# EAGLE board SWD (EAGLE 7.4.0), part 1 of 2
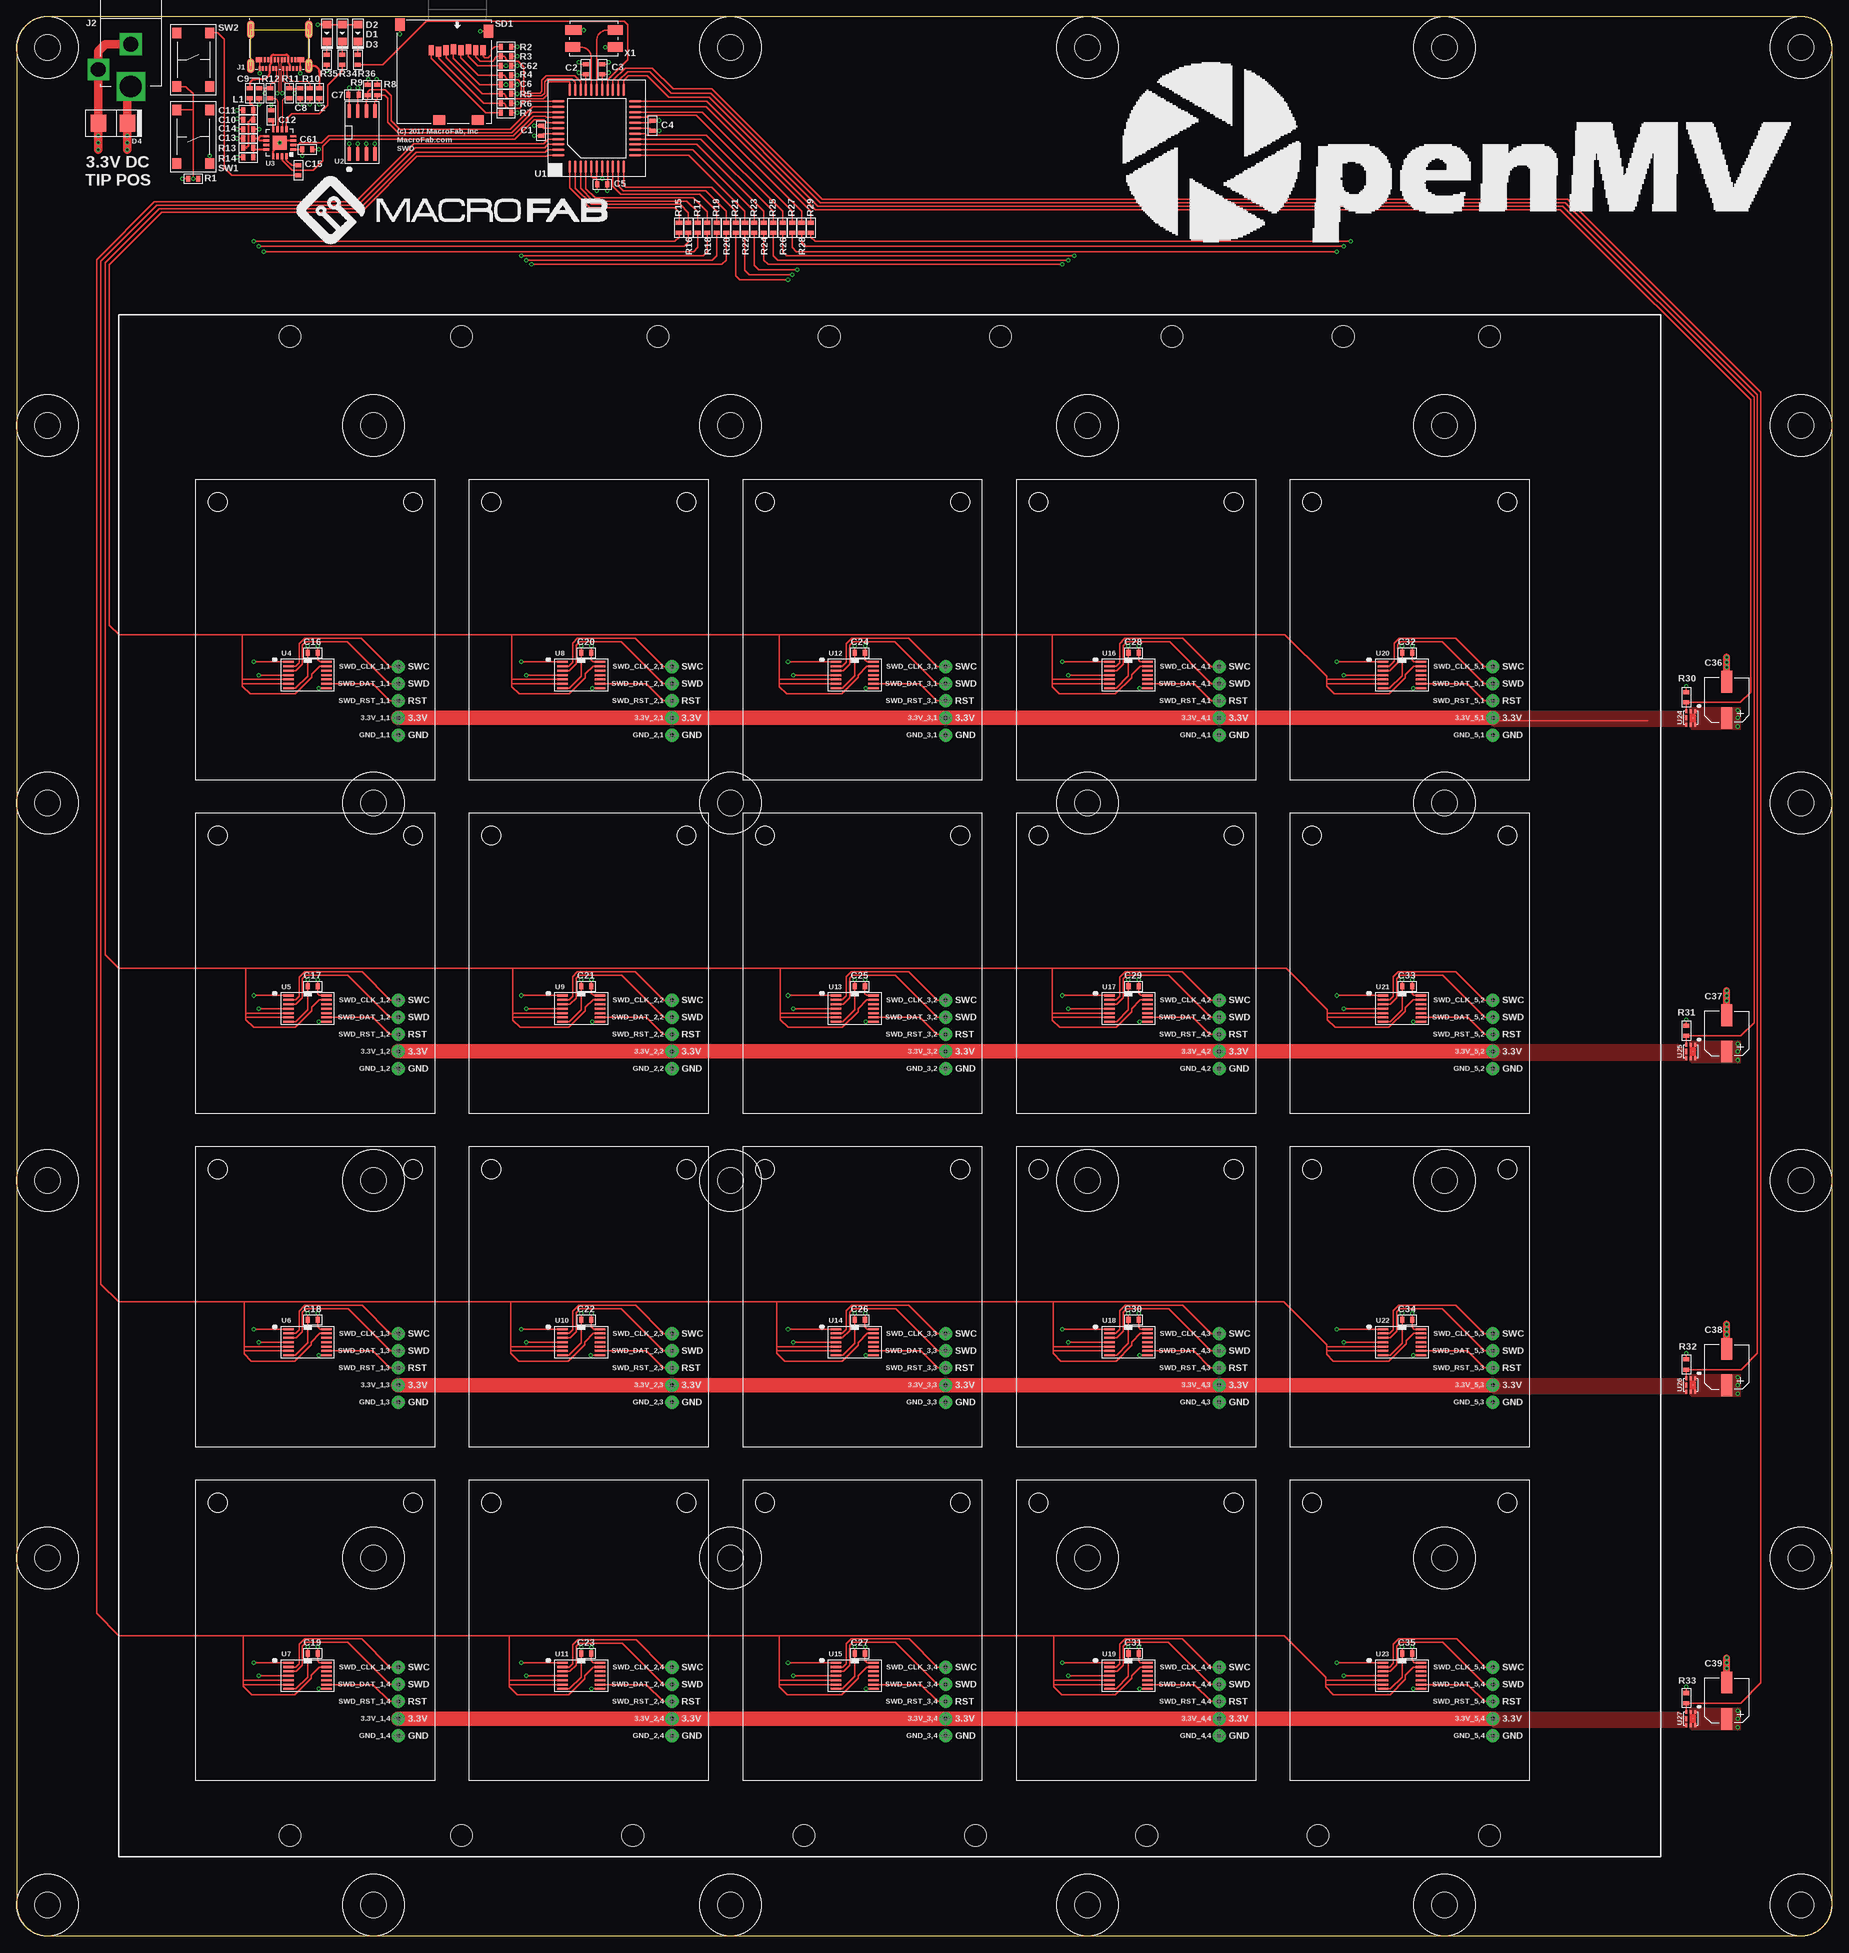
[diagram p9: board, top side]
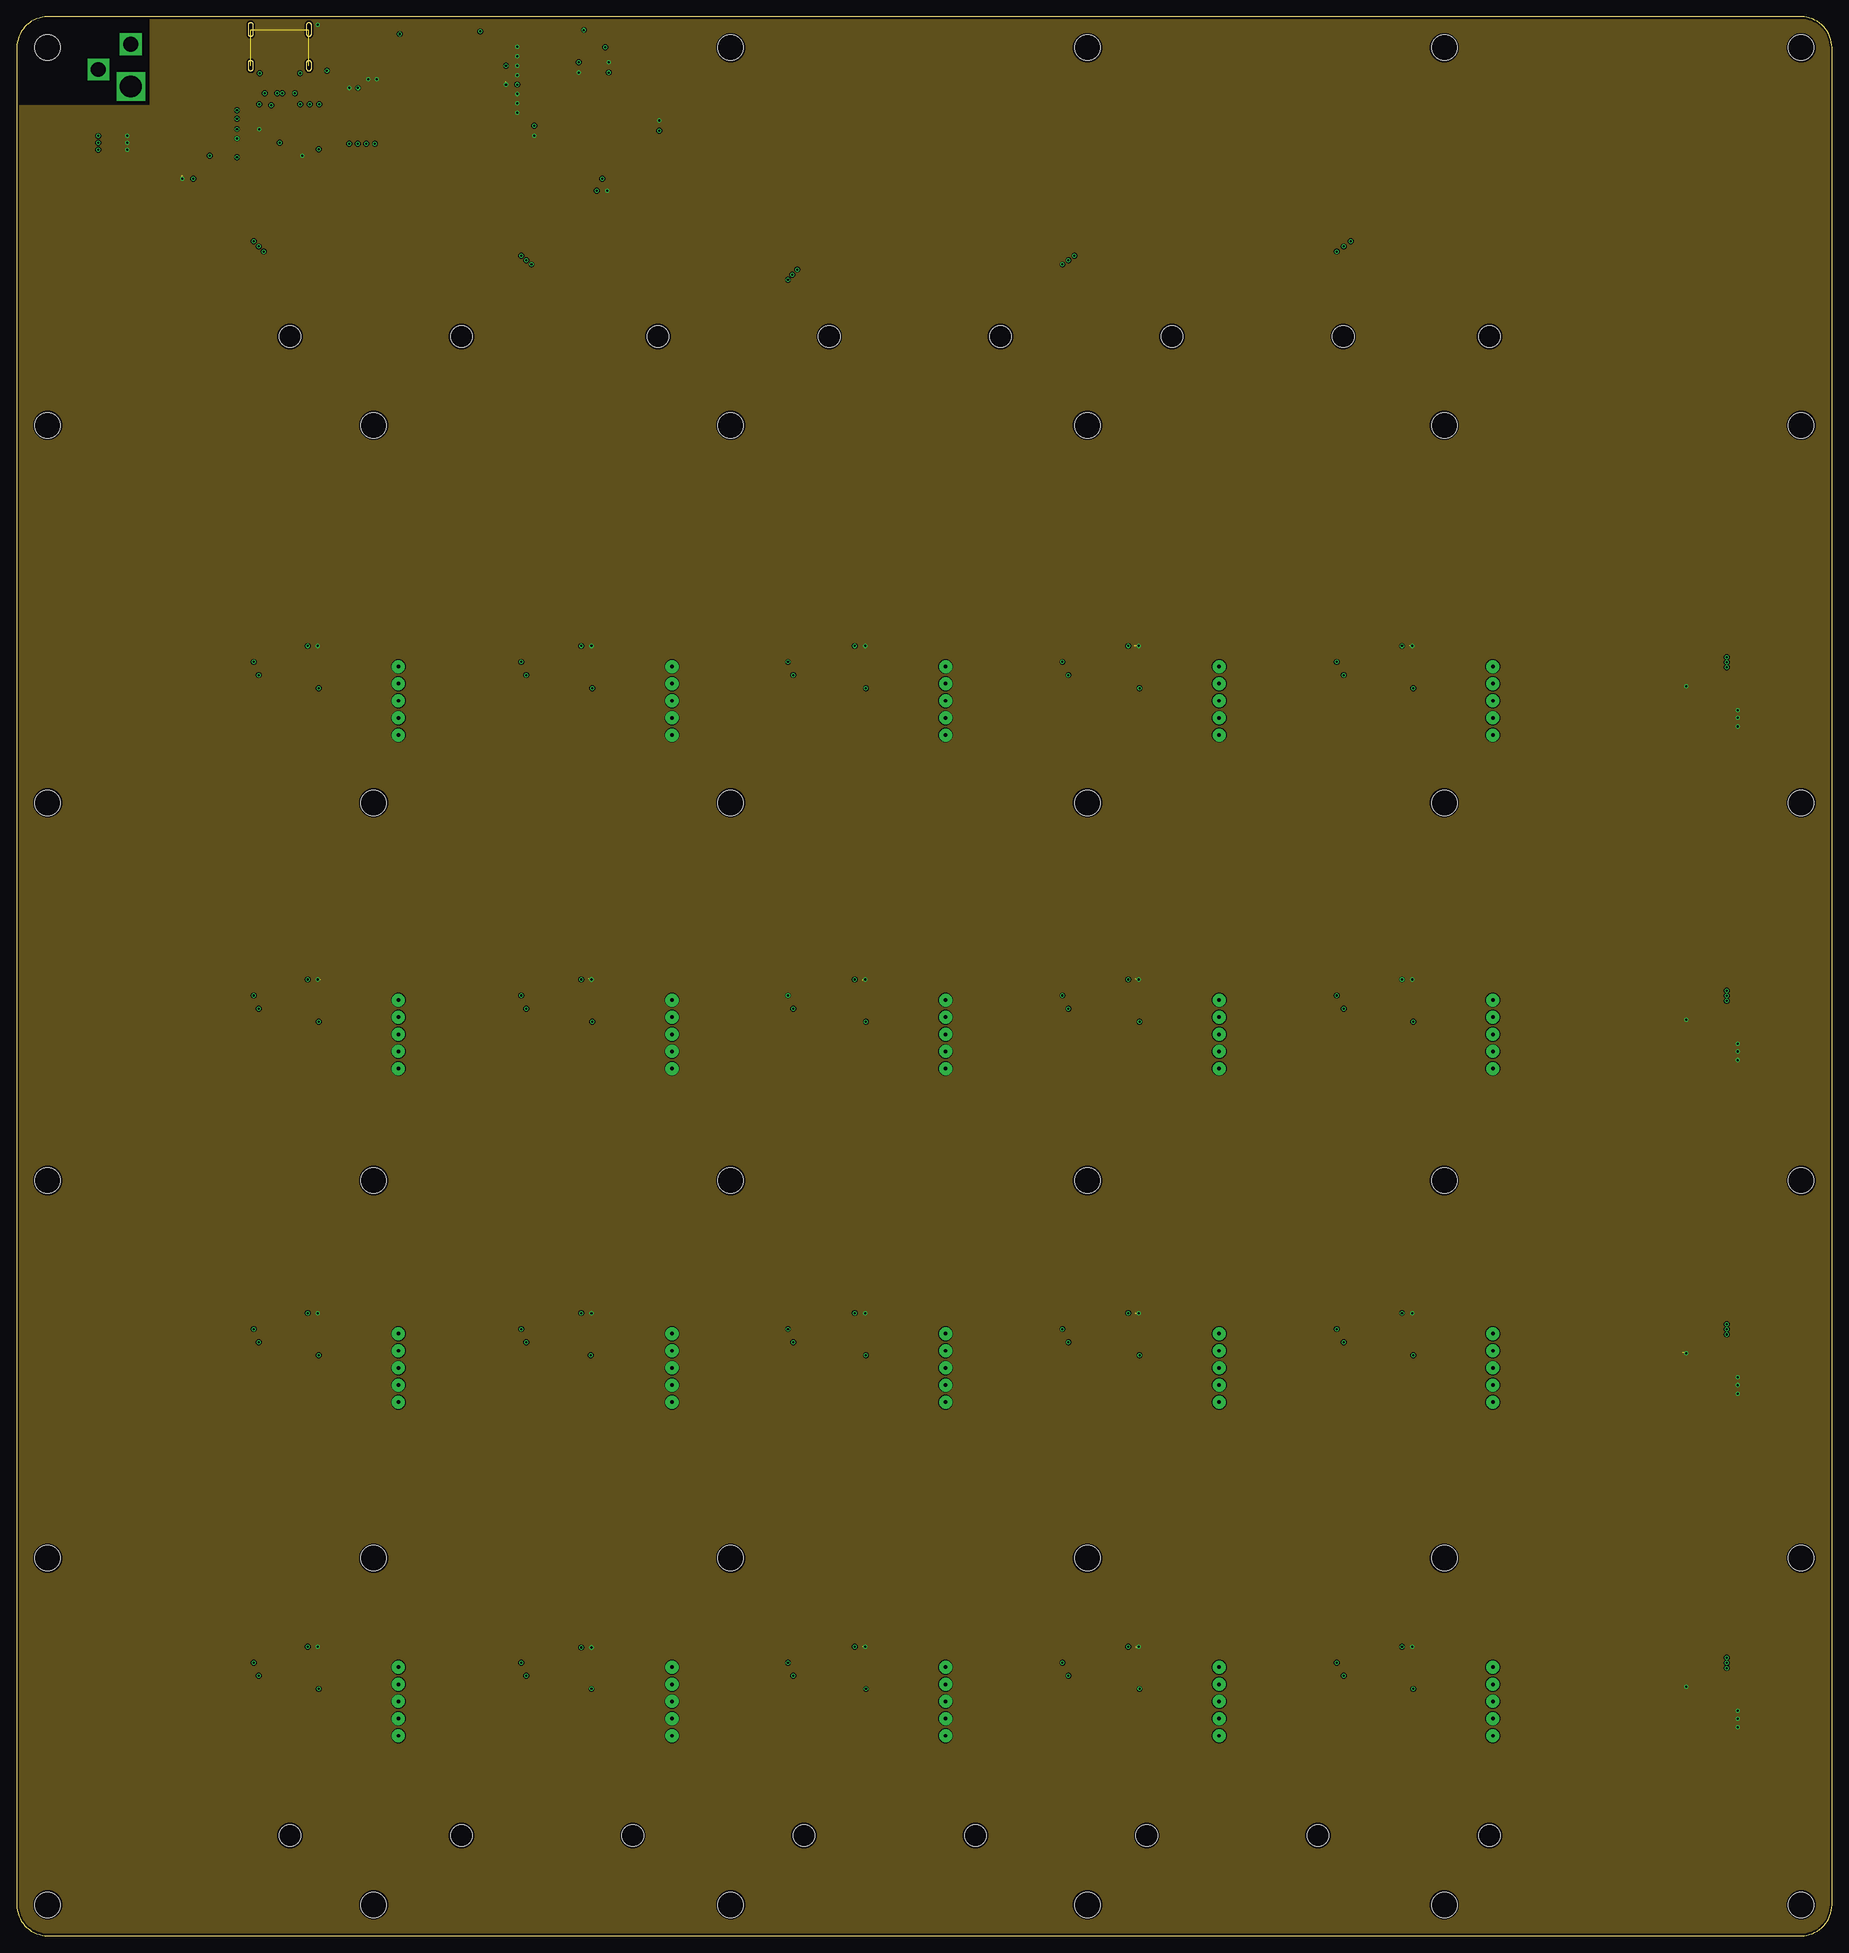
[diagram p10: board, inner layer 3.3V]
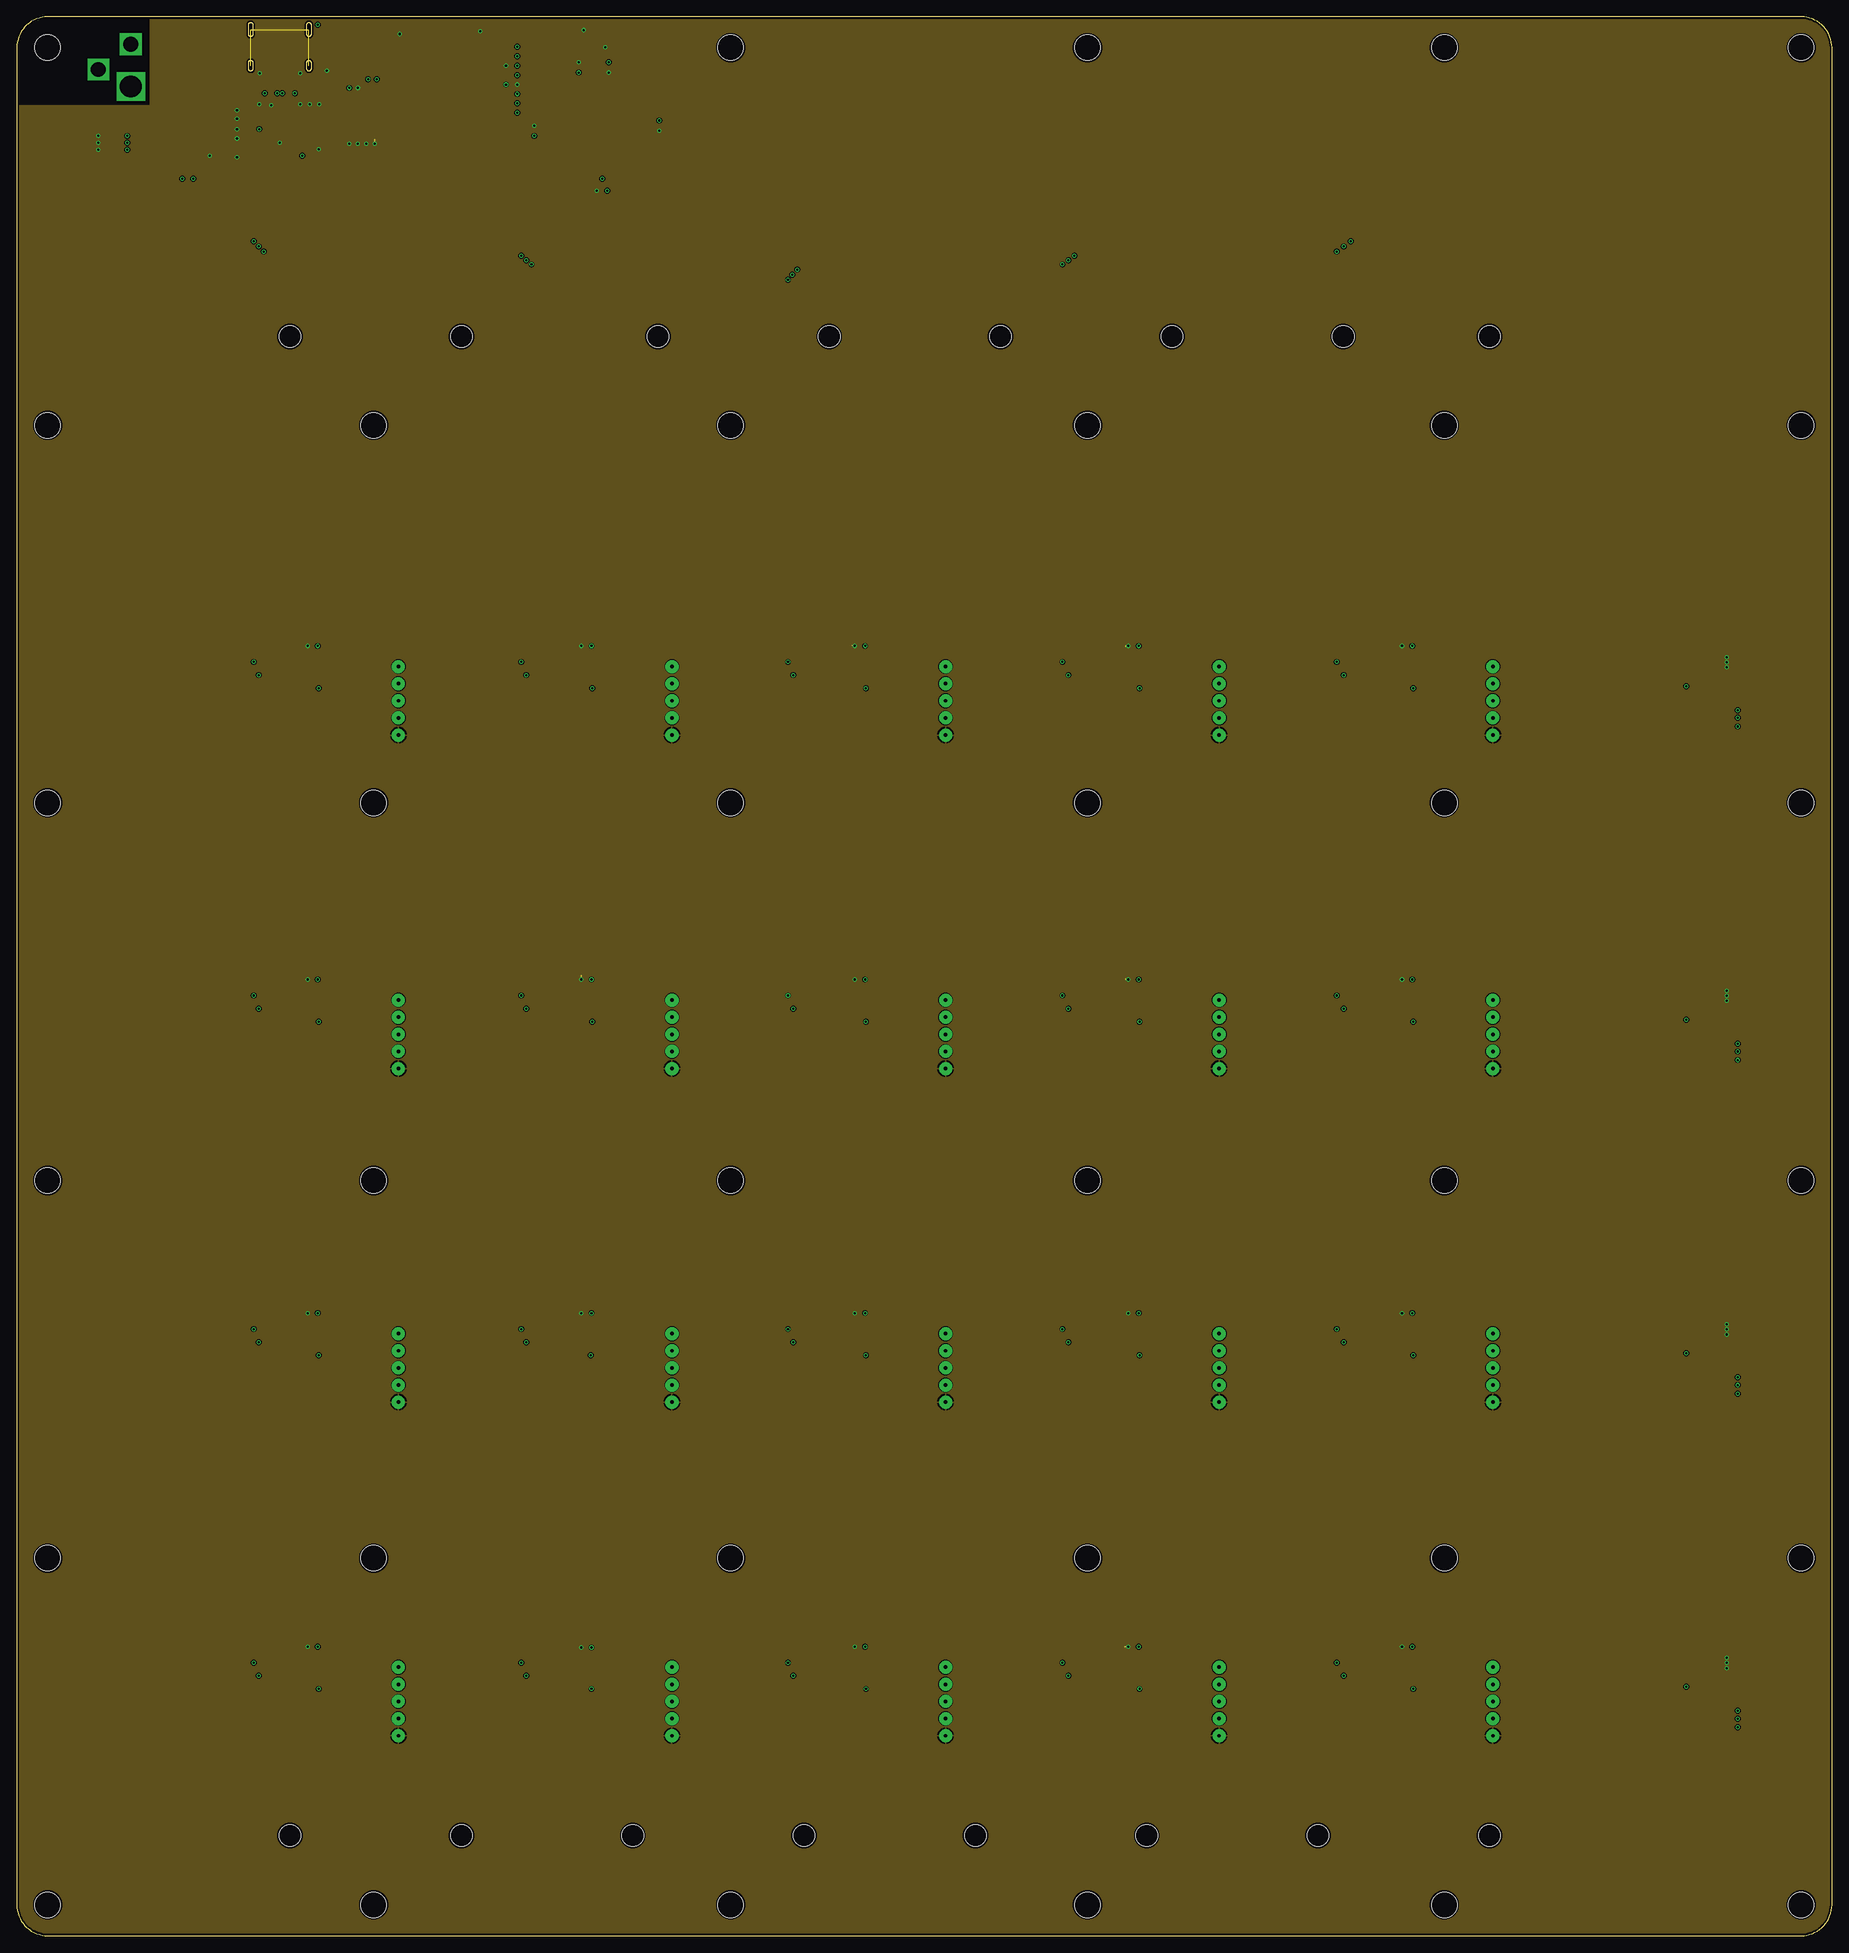
[diagram p11: board, inner layer GND]
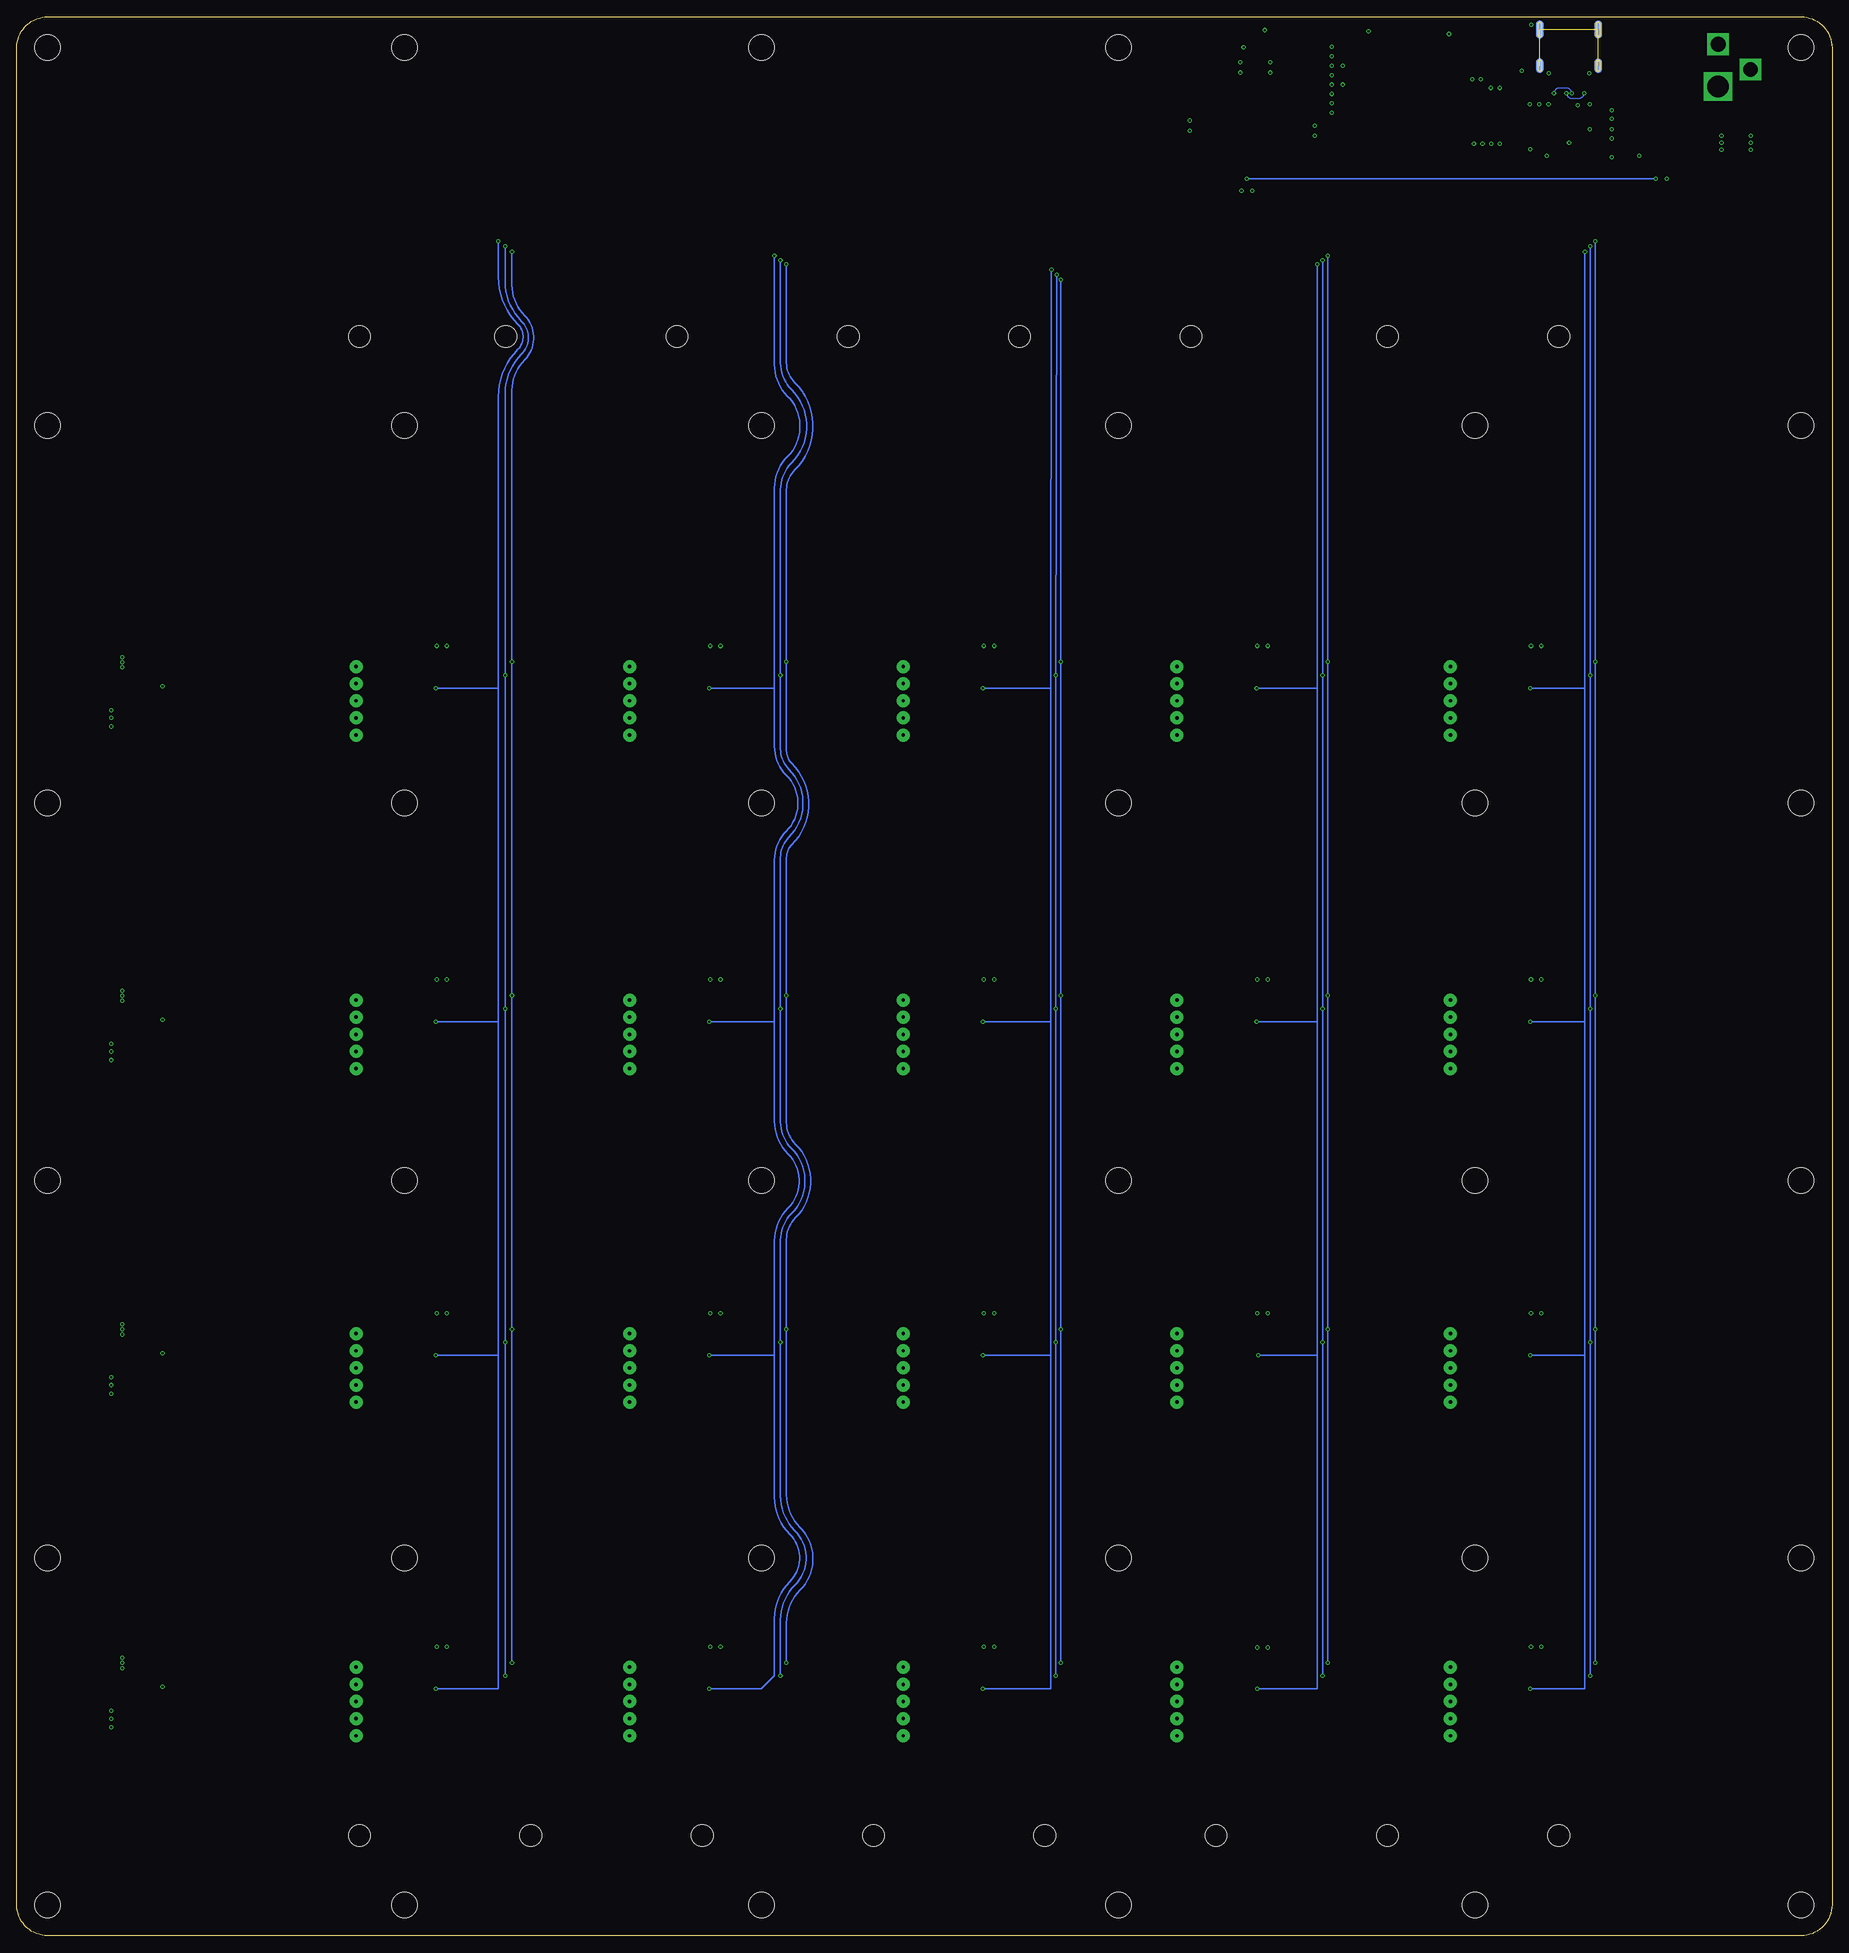
[diagram p12: board, bottom side, seen from below]

Size 269.11 x 284.48 mm. Coordinates in mm from the lower left corner, seen from the top.
Outline: 0,279.91 0,4.57 arc90 4.57,0 264.54,0 arc90 269.11,4.57 269.11,279.91 arc90 264.54,284.48 4.57,284.48 arc90 0,279.91
Copper layers (1*2*15*16): Top 0.035mm / dielectric 0.23mm / 3.3V 0.035mm / dielectric 0.93mm / GND 0.035mm / dielectric 0.23mm / Bottom 0.035mm
Design rules "MF_Standard_4_Layer": minimum track width 5mil, minimum drill 12mil, track to track 5mil, track to pad 5mil, pad to pad 5mil, via to via 5mil, smd to smd 0mil, copper to edge 10mil, drill to drill 10mil, minimum pad ring 6mil, minimum via ring 6mil, stop-mask expansion 2mil, vias tented up to drill 25mil, thermal gap 10mil
Holes 3.25 mm at 40.51,14.86 65.91,14.86 91.31,14.86 116.71,14.86 142.11,14.86 167.51,14.86 192.91,14.86 218.31,14.86 218.31,237.11 196.65,237.11 171.25,237.11 145.85,237.11 120.45,237.11 95.05,237.11 65.91,237.11 40.51,237.11

## Footprints (pad centres in the part's own frame; a part is rotated, then mirrored left to right if it is on the bottom)
0908-4-15-20-75-14-11-0 = drill 0.508 pad 1.93: P$1 0,0
C0603 = smd 0.6 x 0.9: P$1 -0.75,0; P$2 0.75,0
CP6.3MM = smd 1.6 x 3.2: P$1 0,-2.7; P$2 0,2.7
LED0805 = smd 1.1 x 1.25: ANODE 1.25,0; CATHODE -1.25,0
SMBJ = smd 2.3 x 2.5: ANODE 2.15,0; CATH -2.15,0
105450-0101 = smd 0.3 x 0.7: A1 -3,0.41; A2 -2.5,0.41; A3 -2,0.41; A4 -1.5,0.41; A5 -1,0.41; A6 -0.5,0.41; A7 0.5,0.41; A8 1,0.41; A9 1.5,0.41; A10 2,0.41; A11 2.5,0.41; A12 3,0.41; B2 2.25,-0.89; B3 1.75,-0.89; B4 1.25,-0.89; B5 0.75,-0.89; B6 0.25,-0.89; B7 -0.25,-0.89; B8 -0.75,-0.89; B9 -1.25,-0.89; B10 -1.75,-0.89; B11 -2.25,-0.89 | smd 1 x 0.7: B1 3.1,-0.89; B12 -3.1,-0.89 | smd 1.1 x 2.6 bottom: S_B1 -4.32,-5.36; S_B4 4.32,-5.36 | smd 1.1 x 2.1 bottom: S_B2 -4.32,0; S_B3 4.32,0 | smd 1.1 x 2.6: S_T1 -4.32,-5.36; S_T4 4.32,-5.36 | smd 1.1 x 2.1: S_T2 -4.32,0; S_T3 4.32,0
DC_PWR_JACK = drill 3.2 square: PIN 6.25,0 | drill 2.2 square: SLEEVE1 0,0; SLEEVE2 3.75,-4.8
L0603 = smd 0.6 x 0.9: P$1 -0.75,0; P$2 0.75,0
R0603 = smd 0.6 x 0.9: P$1 -0.75,0; P$2 0.75,0
MF-MICROSD = smd 1.4 x 1.9: G0 -6.589,7.001; G1 6.561,6.001 | smd 0.8 x 1.5: PIN1 -1.939,3.151; PIN2 -0.839,2.951; PIN3 0.261,3.151; PIN4 1.361,3.351; PIN5 2.461,3.151; PIN6 3.561,3.351; PIN7 4.661,3.151; PIN8 5.761,3.151 | smd 1.8 x 1.4: PIN9 4.961,-7.149; PIN10 -0.739,-7.149
TACT6MM = smd 1.55 x 1.3: P$1 -3.975,2.45; P$2 3.975,2.45; P$3 -3.975,-2.45; P$4 3.975,-2.45
LQFP44 = smd 1.9 x 0.4: 1 -5.7,4; 2 -5.7,3.2; 3 -5.7,2.4; 4 -5.7,1.6; 5 -5.7,0.8; 6 -5.7,0; 7 -5.7,-0.8; 8 -5.7,-1.6; 9 -5.7,-2.4; 10 -5.7,-3.2; 11 -5.7,-4; 23 5.7,-4; 24 5.7,-3.2; 25 5.7,-2.4; 26 5.7,-1.6; 27 5.7,-0.8; 28 5.7,0; 29 5.7,0.8; 30 5.7,1.6; 31 5.7,2.4; 32 5.7,3.2; 33 5.7,4 | smd 0.4 x 1.9: 12 -4,-5.7; 13 -3.2,-5.7; 14 -2.4,-5.7; 15 -1.6,-5.7; 16 -0.8,-5.7; 17 0,-5.7; 18 0.8,-5.7; 19 1.6,-5.7; 20 2.4,-5.7; 21 3.2,-5.7; 22 4,-5.7; 34 4,5.7; 35 3.2,5.7; 36 2.4,5.7; 37 1.6,5.7; 38 0.8,5.7; 39 0,5.7; 40 -0.8,5.7; 41 -1.6,5.7; 42 -2.4,5.7; 43 -3.2,5.7; 44 -4,5.7
SOIC-8_W = smd 2 x 0.5: 1 -3.185,1.905; 2 -3.185,0.635; 3 -3.185,-0.635; 4 -3.185,-1.905; 5 3.185,-1.905; 6 3.185,-0.635; 7 3.185,0.635; 8 3.185,1.905
FT230X_QFN-16 = smd 0.9 x 0.35: 1 -2,0.975; 2 -2,0.325; 3 -2,-0.325; 4 -2,-0.975; 9 2,-0.975; 10 2,-0.325; 11 2,0.325; 12 2,0.975 | smd 0.35 x 0.9: 5 -0.975,-2; 6 -0.325,-2; 7 0.325,-2; 8 0.975,-2; 13 0.975,2; 14 0.325,2; 15 -0.325,2; 16 -0.975,2 | smd 2.1 x 2.1: PAD 0,0
SN74LV4066A_TSSOP-14 = smd 1.55 x 0.3: P$1 -2.8,1.95; P$2 -2.8,1.3; P$3 -2.8,0.65; P$4 -2.8,0; P$5 -2.8,-0.65; P$6 -2.8,-1.3; P$7 -2.8,-1.95; P$8 2.8,-1.95; P$9 2.8,-1.3; P$10 2.8,-0.65; P$11 2.8,0; P$12 2.8,0.65; P$13 2.8,1.3; P$14 2.8,1.95
SSM6J507NU = smd 0.55 x 0.3: P$1 -1,0.65; P$2 -1,0; P$3 -1,-0.65; P$4 1,-0.65; P$5 1,0; P$6 1,0.65 | smd 0.75 x 0.3: P$7 0,-0.65 | smd 0.1 x 0.1: P$8 0,0.325
MOUNT_HOLE_150MIL = hole 3.81: 0,0
7MMX5MM = smd 1.4 x 2.2: P$1 -1.27,3.15; P$2 1.27,3.15; P$3 1.27,-3.15 | smd 1.4 x 2.4: P$4 -1.27,-3.05

## Placement (x,y rotation side)
3.3V_1,1  [0908-4-15-20-75-14-11-0]  56.57,180.54 180 top
3.3V_1,2  [0908-4-15-20-75-14-11-0]  56.57,131.09 180 top
3.3V_1,3  [0908-4-15-20-75-14-11-0]  56.57,81.64 180 top
3.3V_1,4  [0908-4-15-20-75-14-11-0]  56.57,32.18 180 top
3.3V_2,1  [0908-4-15-20-75-14-11-0]  97.13,180.54 180 top
3.3V_2,2  [0908-4-15-20-75-14-11-0]  97.13,131.09 180 top
3.3V_2,3  [0908-4-15-20-75-14-11-0]  97.13,81.64 180 top
3.3V_2,4  [0908-4-15-20-75-14-11-0]  97.13,32.18 180 top
3.3V_3,1  [0908-4-15-20-75-14-11-0]  137.69,180.54 180 top
3.3V_3,2  [0908-4-15-20-75-14-11-0]  137.69,131.09 180 top
3.3V_3,3  [0908-4-15-20-75-14-11-0]  137.69,81.64 180 top
3.3V_3,4  [0908-4-15-20-75-14-11-0]  137.69,32.18 180 top
3.3V_4,1  [0908-4-15-20-75-14-11-0]  178.26,180.54 180 top
3.3V_4,2  [0908-4-15-20-75-14-11-0]  178.26,131.09 180 top
3.3V_4,3  [0908-4-15-20-75-14-11-0]  178.26,81.64 180 top
3.3V_4,4  [0908-4-15-20-75-14-11-0]  178.26,32.18 180 top
3.3V_5,1  [0908-4-15-20-75-14-11-0]  218.82,180.54 180 top
3.3V_5,2  [0908-4-15-20-75-14-11-0]  218.82,131.09 180 top
3.3V_5,3  [0908-4-15-20-75-14-11-0]  218.82,81.64 180 top
3.3V_5,4  [0908-4-15-20-75-14-11-0]  218.82,32.18 180 top
C1  0.1uF  [C0603]  77.72,267.59 90 top
C2  0.1uF  [C0603]  84.33,276.73 90 top
C3  0.1uF  [C0603]  86.82,276.73 270 top
C4  0.1uF  [C0603]  94.23,268.35 270 top
C5  0.1uF  [C0603]  86.77,259.64 180 top
C6  0.1uF  [C0603]  72.52,274.45 0 top
C7  0.1uF  [C0603]  49.91,272.92 0 top
C8  47pF  [C0603]  42.04,273.18 270 top
C9  47pF  [C0603]  35.94,273.18 270 top
C10  0.1uF  [C0603]  34.29,269.24 180 top
C11  1uF  [C0603]  34.29,270.64 180 top
C12  0.1uF  [C0603]  37.72,269.88 90 top
C13  0.1uF  [C0603]  34.29,266.45 180 top
C14  1uF  [C0603]  34.29,267.84 180 top
C15  0.1uF  [C0603]  41.73,261.75 270 top
C16  0.1uF  [C0603]  43.87,190.2 0 top
C17  0.1uF  [C0603]  43.87,140.74 0 top
C18  0.1uF  [C0603]  43.87,91.29 0 top
C19  0.1uF  [C0603]  43.87,41.83 0 top
C20  0.1uF  [C0603]  84.43,190.2 0 top
C21  0.1uF  [C0603]  84.43,140.74 0 top
C22  0.1uF  [C0603]  84.43,91.29 0 top
C23  0.1uF  [C0603]  84.43,41.83 0 top
C24  0.1uF  [C0603]  124.99,190.2 0 top
C25  0.1uF  [C0603]  124.99,140.74 0 top
C26  0.1uF\  [C0603]  124.99,91.29 0 top
C27  0.1uF  [C0603]  124.99,41.83 0 top
C28  0.1uF  [C0603]  165.56,190.2 0 top
C29  0.1uF  [C0603]  165.56,140.74 0 top
C30  0.1uF  [C0603]  165.56,91.29 0 top
C31  0.1uF  [C0603]  165.56,41.83 0 top
C32  0.1uF  [C0603]  206.12,190.2 0 top
C33  0.1uF  [C0603]  206.12,140.74 0 top
C34  0.1uF  [C0603]  206.12,91.29 0 top
C35  0.1uF  [C0603]  206.12,41.83 0 top
C36  100uF  [CP6.3MM]  253.49,183.21 0 top
C37  100uF  [CP6.3MM]  253.49,133.76 0 top
C38  100uF  [CP6.3MM]  253.49,84.3 0 top
C39  100uF  [CP6.3MM]  253.49,34.85 0 top
C61  0.1uF  [C0603]  43.05,264.85 0 top
C62  0.1uF  [C0603]  72.52,277.24 180 top
D1  MF-LED-0805-RED  [LED0805]  48.26,282.07 90 top
D2  MF-LED-0805-RED  [LED0805]  45.97,282.07 90 top
D3  MF-LED-0805-RED  [LED0805]  50.55,282.07 90 top
D4  SMBJ5.0CA  [SMBJ]  14.22,268.73 180 top
FRAME1  [MF_FRAME_DEFAULT]  56.34,268.35 0 top
GND_1,1  [0908-4-15-20-75-14-11-0]  56.57,178 180 top
GND_1,2  [0908-4-15-20-75-14-11-0]  56.57,128.55 180 top
GND_1,3  [0908-4-15-20-75-14-11-0]  56.57,79.1 180 top
GND_1,4  [0908-4-15-20-75-14-11-0]  56.57,29.64 180 top
GND_2,1  [0908-4-15-20-75-14-11-0]  97.13,178 180 top
GND_2,2  [0908-4-15-20-75-14-11-0]  97.13,128.55 180 top
GND_2,3  [0908-4-15-20-75-14-11-0]  97.13,79.1 180 top
GND_2,4  [0908-4-15-20-75-14-11-0]  97.13,29.64 180 top
GND_3,1  [0908-4-15-20-75-14-11-0]  137.69,178 180 top
GND_3,2  [0908-4-15-20-75-14-11-0]  137.69,128.55 180 top
GND_3,3  [0908-4-15-20-75-14-11-0]  137.69,79.1 180 top
GND_3,4  [0908-4-15-20-75-14-11-0]  137.69,29.64 180 top
GND_4,1  [0908-4-15-20-75-14-11-0]  178.26,178 180 top
GND_4,2  [0908-4-15-20-75-14-11-0]  178.26,128.55 180 top
GND_4,3  [0908-4-15-20-75-14-11-0]  178.26,79.1 180 top
GND_4,4  [0908-4-15-20-75-14-11-0]  178.26,29.64 180 top
GND_5,1  [0908-4-15-20-75-14-11-0]  218.82,178 180 top
GND_5,2  [0908-4-15-20-75-14-11-0]  218.82,128.55 180 top
GND_5,3  [0908-4-15-20-75-14-11-0]  218.82,79.1 180 top
GND_5,4  [0908-4-15-20-75-14-11-0]  218.82,29.64 180 top
J1  [105450-0101]  38.99,277.24 180 top
J2  KLDX-0202-A  [DC_PWR_JACK]  16.89,280.42 270 top
L1  MI0603K300R-10  [L0603]  34.54,273.18 270 top
L2  MI0603K300R-10  [L0603]  44.83,273.18 270 top
R1  10K  [R0603]  26.16,260.48 0 top
R2  10K  [R0603]  72.52,280.04 180 top
R3  10K  [R0603]  72.52,278.64 180 top
R4  10K  [R0603]  72.52,275.84 180 top
R5  10K  [R0603]  72.52,273.05 180 top
R6  10K  [R0603]  72.52,271.65 180 top
R7  10K  [R0603]  72.52,270.26 180 top
R8  10K  [R0603]  53.42,273.63 270 top
R9  10K  [R0603]  52.02,273.63 270 top
R10  5.1K  [R0603]  43.43,273.18 270 top
R11  27  [R0603]  40.39,273.18 270 top
R12  27  [R0603]  37.59,273.18 270 top
R13  4.7K  [R0603]  34.29,265.05 180 top
R14  10K  [R0603]  34.29,263.65 0 top
R15  100  [R0603]  98.17,253.24 90 top
R16  100  [R0603]  99.57,253.24 90 top
R17  100  [R0603]  100.97,253.24 90 top
R18  100  [R0603]  102.36,253.24 90 top
R19  100  [R0603]  103.76,253.24 90 top
R20  100  [R0603]  105.16,253.24 90 top
R21  100  [R0603]  106.55,253.24 90 top
R22  100  [R0603]  107.95,253.24 90 top
R23  100  [R0603]  109.35,253.24 90 top
R24  100  [R0603]  110.74,253.24 90 top
R25  100  [R0603]  112.14,253.24 90 top
R26  100  [R0603]  113.54,253.24 90 top
R27  100  [R0603]  114.94,253.24 90 top
R28  100  [R0603]  116.33,253.24 90 top
R29  100  [R0603]  117.73,253.24 90 top
R30  10K  [R0603]  247.52,183.59 270 top
R31  10K  [R0603]  247.52,134.14 270 top
R32  10K  [R0603]  247.52,84.68 270 top
R33  10K  [R0603]  247.52,35.23 270 top
R34  360  [R0603]  48.26,278.13 270 top
R35  360  [R0603]  45.97,278.13 270 top
R36  360  [R0603]  50.55,278.13 270 top
SD1  MF-MICROSD  [MF-MICROSD]  63.37,276.35 0 top
SW1  MF-SW-TACT-6MM  [TACT6MM]  26.16,266.7 90 top
SW2  MF-SW-TACT-6MM  [TACT6MM]  26.16,278.13 270 top
SWD_CLK_1,1  [0908-4-15-20-75-14-11-0]  56.57,188.16 180 top
SWD_CLK_1,2  [0908-4-15-20-75-14-11-0]  56.57,138.71 180 top
SWD_CLK_1,3  [0908-4-15-20-75-14-11-0]  56.57,89.26 180 top
SWD_CLK_1,4  [0908-4-15-20-75-14-11-0]  56.57,39.8 180 top
SWD_CLK_2,1  [0908-4-15-20-75-14-11-0]  97.13,188.16 180 top
SWD_CLK_2,2  [0908-4-15-20-75-14-11-0]  97.13,138.71 180 top
SWD_CLK_2,3  [0908-4-15-20-75-14-11-0]  97.13,89.26 180 top
SWD_CLK_2,4  [0908-4-15-20-75-14-11-0]  97.13,39.8 180 top
SWD_CLK_3,1  [0908-4-15-20-75-14-11-0]  137.69,188.16 180 top
SWD_CLK_3,2  [0908-4-15-20-75-14-11-0]  137.69,138.71 180 top
SWD_CLK_3,3  [0908-4-15-20-75-14-11-0]  137.69,89.26 180 top
SWD_CLK_3,4  [0908-4-15-20-75-14-11-0]  137.69,39.8 180 top
SWD_CLK_4,1  [0908-4-15-20-75-14-11-0]  178.26,188.16 180 top
SWD_CLK_4,2  [0908-4-15-20-75-14-11-0]  178.26,138.71 180 top
SWD_CLK_4,3  [0908-4-15-20-75-14-11-0]  178.26,89.26 180 top
SWD_CLK_4,4  [0908-4-15-20-75-14-11-0]  178.26,39.8 180 top
SWD_CLK_5,1  [0908-4-15-20-75-14-11-0]  218.82,188.16 180 top
SWD_CLK_5,2  [0908-4-15-20-75-14-11-0]  218.82,138.71 180 top
SWD_CLK_5,3  [0908-4-15-20-75-14-11-0]  218.82,89.26 180 top
SWD_CLK_5,4  [0908-4-15-20-75-14-11-0]  218.82,39.8 180 top
SWD_DAT_1,1  [0908-4-15-20-75-14-11-0]  56.57,185.62 180 top
SWD_DAT_1,2  [0908-4-15-20-75-14-11-0]  56.57,136.17 180 top
SWD_DAT_1,3  [0908-4-15-20-75-14-11-0]  56.57,86.72 180 top
SWD_DAT_1,4  [0908-4-15-20-75-14-11-0]  56.57,37.26 180 top
SWD_DAT_2,1  [0908-4-15-20-75-14-11-0]  97.13,185.62 180 top
SWD_DAT_2,2  [0908-4-15-20-75-14-11-0]  97.13,136.17 180 top
SWD_DAT_2,3  [0908-4-15-20-75-14-11-0]  97.13,86.72 180 top
SWD_DAT_2,4  [0908-4-15-20-75-14-11-0]  97.13,37.26 180 top
SWD_DAT_3,1  [0908-4-15-20-75-14-11-0]  137.69,185.62 180 top
SWD_DAT_3,2  [0908-4-15-20-75-14-11-0]  137.69,136.17 180 top
SWD_DAT_3,3  [0908-4-15-20-75-14-11-0]  137.69,86.72 180 top
SWD_DAT_3,4  [0908-4-15-20-75-14-11-0]  137.69,37.26 180 top
SWD_DAT_4,1  [0908-4-15-20-75-14-11-0]  178.26,185.62 180 top
SWD_DAT_4,2  [0908-4-15-20-75-14-11-0]  178.26,136.17 180 top
SWD_DAT_4,3  [0908-4-15-20-75-14-11-0]  178.26,86.72 180 top
SWD_DAT_4,4  [0908-4-15-20-75-14-11-0]  178.26,37.26 180 top
SWD_DAT_5,1  [0908-4-15-20-75-14-11-0]  218.82,185.62 180 top
SWD_DAT_5,2  [0908-4-15-20-75-14-11-0]  218.82,136.17 180 top
SWD_DAT_5,3  [0908-4-15-20-75-14-11-0]  218.82,86.72 180 top
SWD_DAT_5,4  [0908-4-15-20-75-14-11-0]  218.82,37.26 180 top
SWD_RST_1,1  [0908-4-15-20-75-14-11-0]  56.57,183.08 180 top
SWD_RST_1,2  [0908-4-15-20-75-14-11-0]  56.57,133.63 180 top
SWD_RST_1,3  [0908-4-15-20-75-14-11-0]  56.57,84.18 180 top
SWD_RST_1,4  [0908-4-15-20-75-14-11-0]  56.57,34.72 180 top
SWD_RST_2,1  [0908-4-15-20-75-14-11-0]  97.13,183.08 180 top
SWD_RST_2,2  [0908-4-15-20-75-14-11-0]  97.13,133.63 180 top
SWD_RST_2,3  [0908-4-15-20-75-14-11-0]  97.13,84.18 180 top
SWD_RST_2,4  [0908-4-15-20-75-14-11-0]  97.13,34.72 180 top
SWD_RST_3,1  [0908-4-15-20-75-14-11-0]  137.69,183.08 180 top
SWD_RST_3,2  [0908-4-15-20-75-14-11-0]  137.69,133.63 180 top
SWD_RST_3,3  [0908-4-15-20-75-14-11-0]  137.69,84.18 180 top
SWD_RST_3,4  [0908-4-15-20-75-14-11-0]  137.69,34.72 180 top
SWD_RST_4,1  [0908-4-15-20-75-14-11-0]  178.26,183.08 180 top
SWD_RST_4,2  [0908-4-15-20-75-14-11-0]  178.26,133.63 180 top
SWD_RST_4,3  [0908-4-15-20-75-14-11-0]  178.26,84.18 180 top
SWD_RST_4,4  [0908-4-15-20-75-14-11-0]  178.26,34.72 180 top
SWD_RST_5,1  [0908-4-15-20-75-14-11-0]  218.82,183.08 180 top
SWD_RST_5,2  [0908-4-15-20-75-14-11-0]  218.82,133.63 180 top
SWD_RST_5,3  [0908-4-15-20-75-14-11-0]  218.82,84.18 180 top
SWD_RST_5,4  [0908-4-15-20-75-14-11-0]  218.82,34.72 180 top
U1  P8X32A-Q44  [LQFP44]  85.98,267.97 90 top
U2  CAT24C512WI-GT3  [SOIC-8_W]  51.18,267.33 90 top
U3  FT230XQ-R  [FT230X_QFN-16]  38.99,265.81 180 top
U4  SN74LV4066APWR  [SN74LV4066A_TSSOP-14]  43.1,186.89 0 top
U5  SN74LV4066APWR  [SN74LV4066A_TSSOP-14]  43.1,137.44 0 top
U6  SN74LV4066APWR  [SN74LV4066A_TSSOP-14]  43.1,87.99 0 top
U7  SN74LV4066APWR  [SN74LV4066A_TSSOP-14]  43.1,38.53 0 top
U8  SN74LV4066APWR  [SN74LV4066A_TSSOP-14]  83.67,186.89 0 top
U9  SN74LV4066APWR  [SN74LV4066A_TSSOP-14]  83.67,137.44 0 top
U10  SN74LV4066APWR  [SN74LV4066A_TSSOP-14]  83.67,87.99 0 top
U11  SN74LV4066APWR  [SN74LV4066A_TSSOP-14]  83.67,38.53 0 top
U12  SN74LV4066APWR  [SN74LV4066A_TSSOP-14]  124.23,186.89 0 top
U13  SN74LV4066APWR  [SN74LV4066A_TSSOP-14]  124.23,137.44 0 top
U14  SN74LV4066APWR  [SN74LV4066A_TSSOP-14]  124.23,87.99 0 top
U15  SN74LV4066APWR  [SN74LV4066A_TSSOP-14]  124.23,38.53 0 top
U16  SN74LV4066APWR  [SN74LV4066A_TSSOP-14]  164.8,186.89 0 top
U17  SN74LV4066APWR  [SN74LV4066A_TSSOP-14]  164.8,137.44 0 top
U18  SN74LV4066APWR  [SN74LV4066A_TSSOP-14]  164.8,87.99 0 top
U19  SN74LV4066APWR  [SN74LV4066A_TSSOP-14]  164.8,38.53 0 top
U20  SN74LV4066APWR  [SN74LV4066A_TSSOP-14]  205.36,186.89 0 top
U21  SN74LV4066APWR  [SN74LV4066A_TSSOP-14]  205.36,137.44 0 top
U22  SN74LV4066APWR  [SN74LV4066A_TSSOP-14]  205.36,87.99 0 top
U23  SN74LV4066APWR  [SN74LV4066A_TSSOP-14]  205.36,38.53 0 top
U24  SSM6J507NU,LF  [SSM6J507NU]  248.16,180.54 270 top
U25  SSM6J507NU,LF  [SSM6J507NU]  248.16,131.09 270 top
U26  SSM6J507NU,LF  [SSM6J507NU]  248.16,81.64 270 top
U27  SSM6J507NU,LF  [SSM6J507NU]  248.16,32.18 270 top
U$24  [MOUNT_HOLE_150MIL]  4.57,279.91 0 top
U$25  [MOUNT_HOLE_150MIL]  4.57,4.57 0 top
U$26  [MOUNT_HOLE_150MIL]  264.54,4.57 0 top
U$27  [MOUNT_HOLE_150MIL]  264.54,279.91 0 top
U$28  [MOUNT_HOLE_150MIL]  4.57,55.98 0 top
U$29  [MOUNT_HOLE_150MIL]  4.57,111.96 0 top
U$30  [MOUNT_HOLE_150MIL]  4.57,167.94 0 top
U$31  [MOUNT_HOLE_150MIL]  4.57,223.93 0 top
U$32  [MOUNT_HOLE_150MIL]  264.54,55.98 0 top
U$33  [MOUNT_HOLE_150MIL]  264.54,111.96 0 top
U$34  [MOUNT_HOLE_150MIL]  264.54,167.94 0 top
U$35  [MOUNT_HOLE_150MIL]  264.54,223.93 0 top
U$36  [MOUNT_HOLE_150MIL]  52.91,4.57 0 top
U$37  [MOUNT_HOLE_150MIL]  105.82,4.57 0 top
U$38  [MOUNT_HOLE_150MIL]  158.72,4.57 0 top
U$39  [MOUNT_HOLE_150MIL]  211.63,4.57 0 top
U$40  [MOUNT_HOLE_150MIL]  105.82,279.91 0 top
U$41  [MOUNT_HOLE_150MIL]  158.72,279.91 0 top
U$42  [MOUNT_HOLE_150MIL]  211.63,279.91 0 top
U$43  [MOUNT_HOLE_150MIL]  52.91,55.98 0 top
U$44  [MOUNT_HOLE_150MIL]  105.82,55.98 0 top
U$45  [MOUNT_HOLE_150MIL]  158.72,55.98 0 top
U$46  [MOUNT_HOLE_150MIL]  211.63,55.98 0 top
U$47  [MOUNT_HOLE_150MIL]  52.91,111.96 0 top
U$48  [MOUNT_HOLE_150MIL]  105.82,111.96 0 top
U$49  [MOUNT_HOLE_150MIL]  158.72,111.96 0 top
U$50  [MOUNT_HOLE_150MIL]  211.63,111.96 0 top
U$51  [MOUNT_HOLE_150MIL]  52.91,167.94 0 top
U$52  [MOUNT_HOLE_150MIL]  105.82,167.94 0 top
U$53  [MOUNT_HOLE_150MIL]  158.72,167.94 0 top
U$54  [MOUNT_HOLE_150MIL]  211.63,167.94 0 top
U$55  [MOUNT_HOLE_150MIL]  52.91,223.93 0 top
U$56  [MOUNT_HOLE_150MIL]  105.82,223.93 0 top
U$57  [MOUNT_HOLE_150MIL]  158.72,223.93 0 top
U$58  [MOUNT_HOLE_150MIL]  211.63,223.93 0 top
U$59  MF_LOGOLOGO_TEXT  [MF_LOGO_TEXT]  41.68,250.72 0 top
UNIT1  OPENMV3  [OPENMV3]  188.72,23.04 0 top
UNIT2  OPENMV3  [OPENMV3]  148.16,23.04 0 top
UNIT3  OPENMV3  [OPENMV3]  107.59,23.04 0 top
UNIT4  OPENMV3  [OPENMV3]  67.03,23.04 0 top
UNIT5  OPENMV3  [OPENMV3]  26.47,23.04 0 top
UNIT6  OPENMV3  [OPENMV3]  188.72,72.49 0 top
UNIT7  OPENMV3  [OPENMV3]  148.16,72.49 0 top
UNIT8  OPENMV3  [OPENMV3]  107.59,72.49 0 top
UNIT9  OPENMV3  [OPENMV3]  67.03,72.49 0 top
UNIT10  OPENMV3  [OPENMV3]  26.47,72.49 0 top
UNIT11  OPENMV3  [OPENMV3]  188.72,121.95 0 top
UNIT12  OPENMV3  [OPENMV3]  148.16,121.95 0 top
UNIT13  OPENMV3  [OPENMV3]  107.59,121.95 0 top
UNIT14  OPENMV3  [OPENMV3]  67.03,121.95 0 top
UNIT15  OPENMV3  [OPENMV3]  26.47,121.95 0 top
UNIT16  OPENMV3  [OPENMV3]  188.72,171.4 0 top
UNIT17  OPENMV3  [OPENMV3]  148.16,171.4 0 top
UNIT18  OPENMV3  [OPENMV3]  107.59,171.4 0 top
UNIT19  OPENMV3  [OPENMV3]  67.03,171.4 0 top
UNIT20  OPENMV3  [OPENMV3]  26.47,171.4 0 top
X1  ABMM-6.000MHZ-B2-T  [7MMX5MM]  85.57,281.25 270 top